# EAGLE design nintendac (EAGLE 7.7.0)
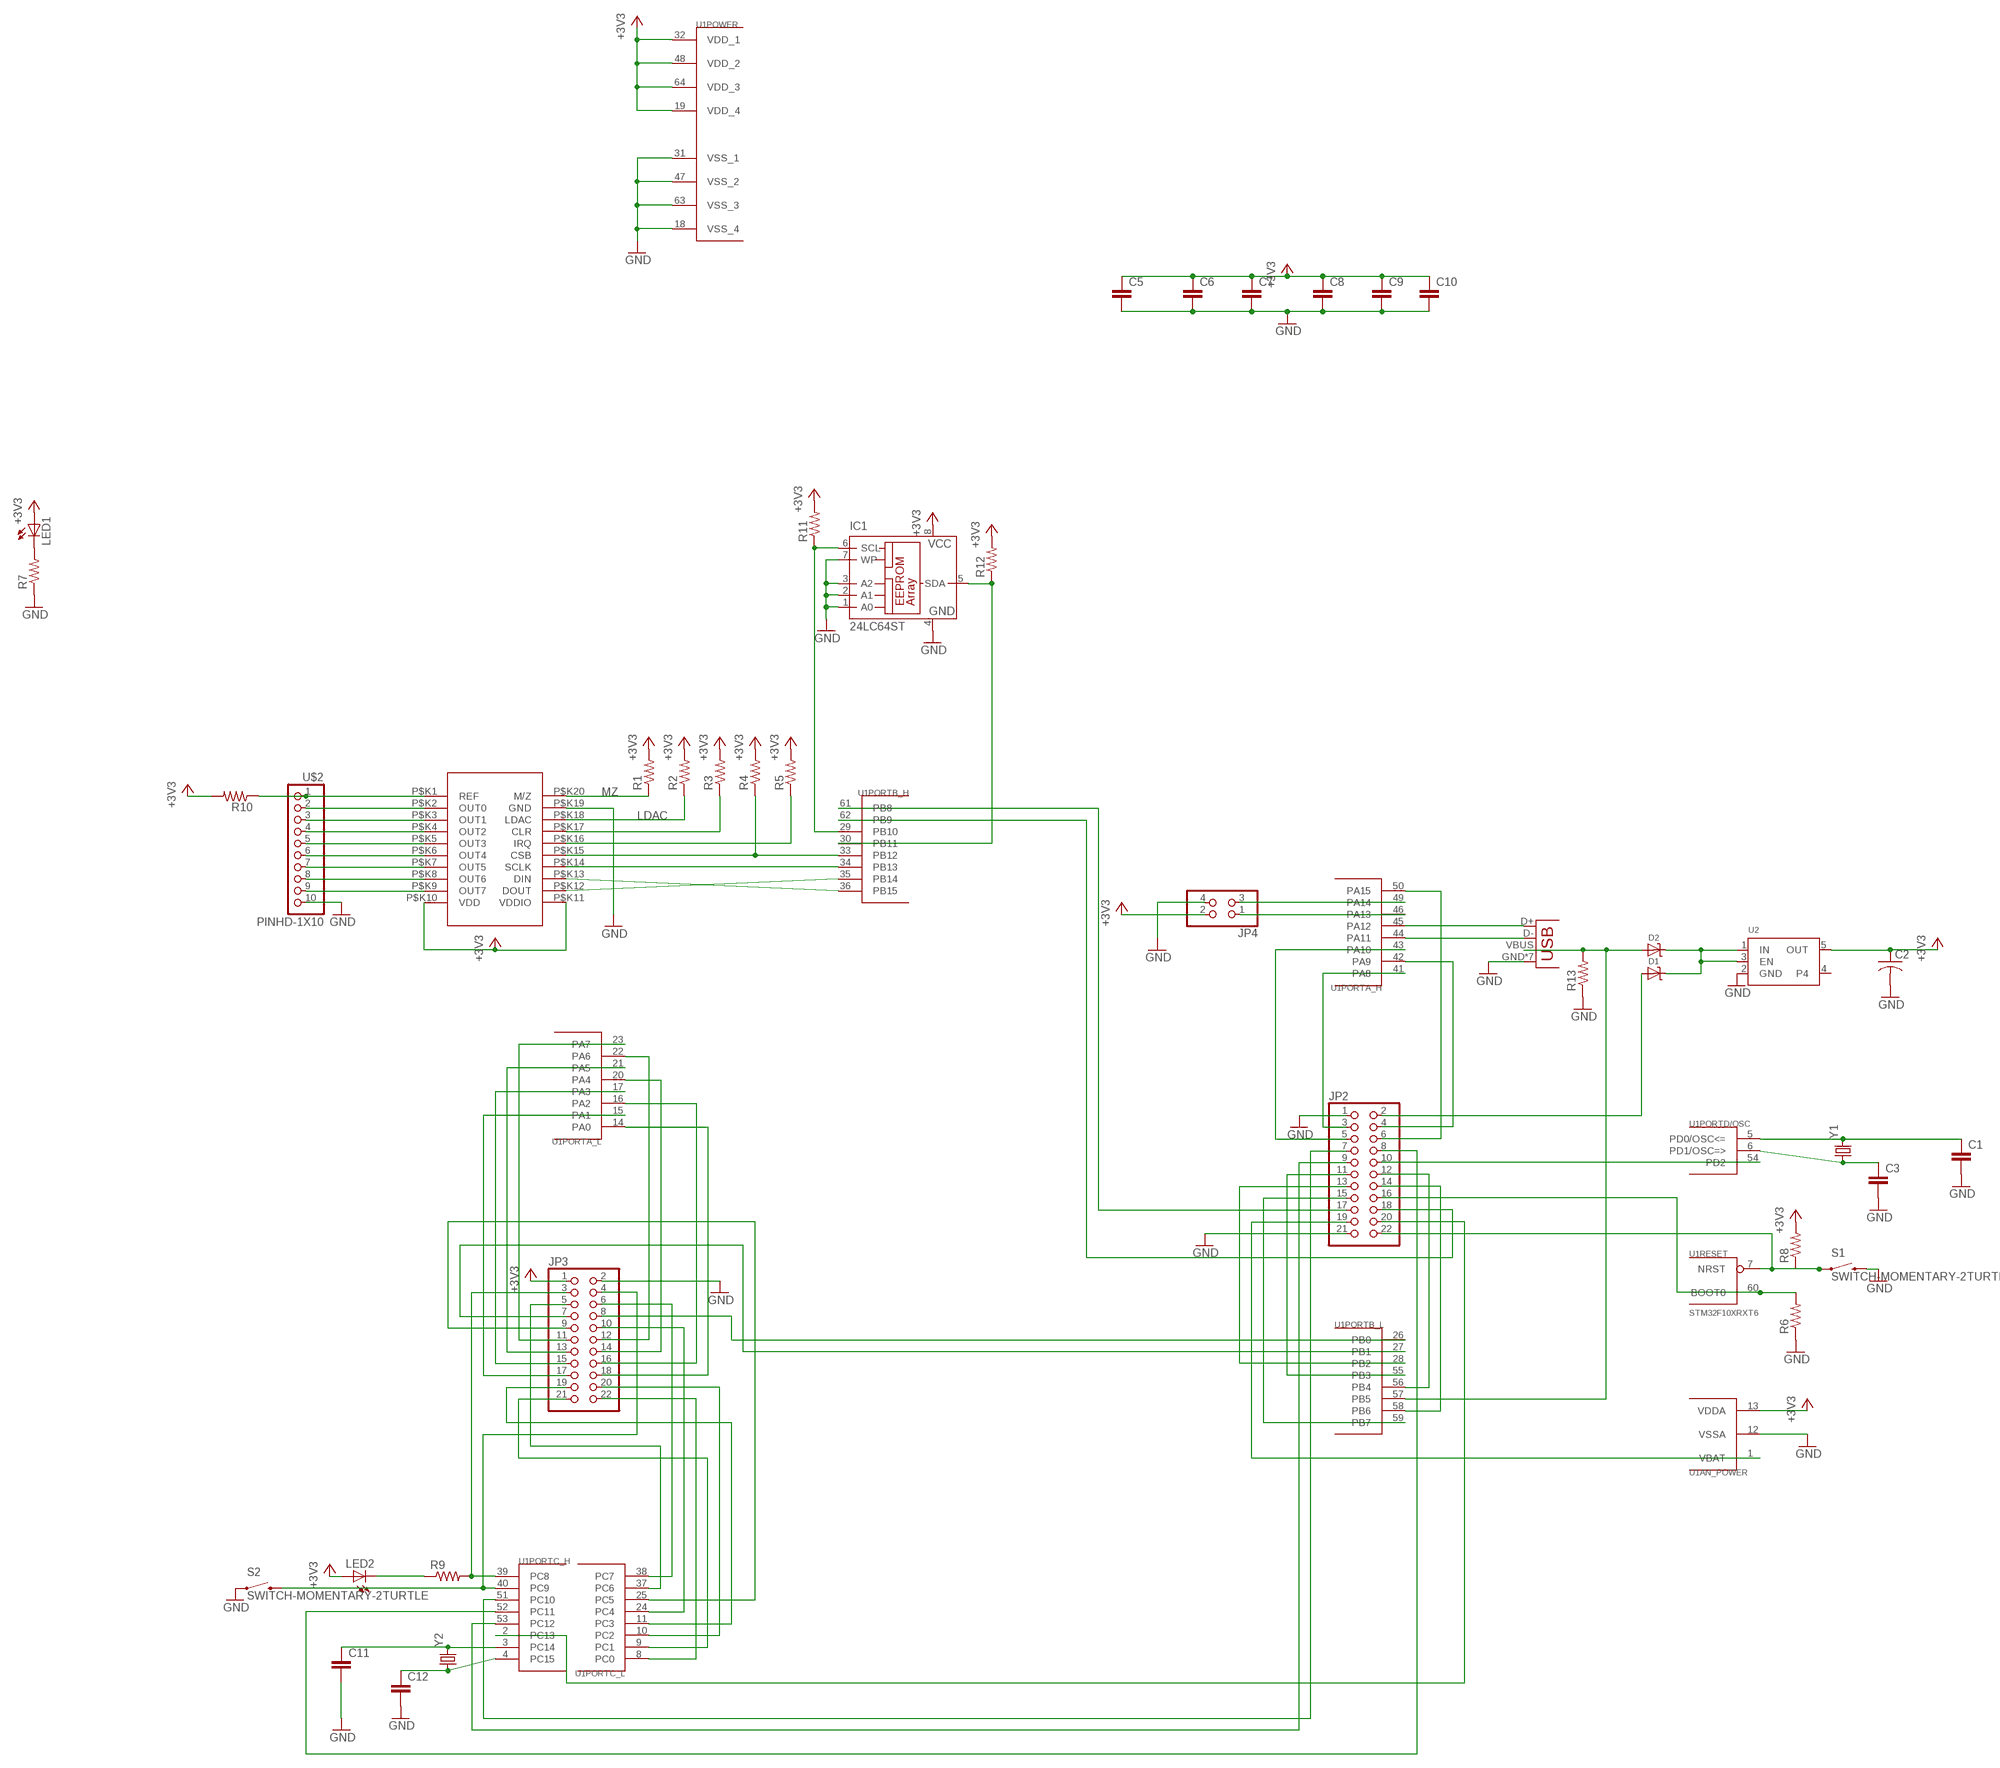
[diagram p0: schematic, sheet 1]

## Parts
C1  CAP0805  [0805]
C2  C-USC1210  [C1210]
C3  CAP0805  [0805]
C5  CAP0805  [0805]
C6  CAP0805  [0805]
C7  CAP0805  [0805]
C8  CAP0805  [0805]
C9  CAP0805  [0805]
C10  CAP0805  [0805]
C11  CAP0805  [0805]
C12  CAP0805  [0805]
D1  DIODE-SCHOTTKYSOD-123  [SOD-123]
D2  DIODE-SCHOTTKYSOD-123  [SOD-123]
IC1  24LC64ST  [TSSOP8]
JP2  PINHD-2X11  [2X11]
JP3  PINHD-2X11  [2X11]
JP4  PINHD-2X2  [2X02]
LED1  LEDCHIP-LED0805  [CHIP-LED0805]
LED2  LEDCHIP-LED0805  [CHIP-LED0805]
R1  RESISTOR0805-RES  [0805]
R2  RESISTOR0805-RES  [0805]
R3  RESISTOR0805-RES  [0805]
R4  RESISTOR0805-RES  [0805]
R5  RESISTOR0805-RES  [0805]
R6  RESISTOR0805-RES  [0805]
R7  RESISTOR0805-RES  [0805]
R8  RESISTOR0805-RES  [0805]
R9  RESISTOR0805-RES  [0805]
R10  RESISTOR0805-RES  [0805]
R11  RESISTOR0805-RES  [0805]
R12  RESISTOR0805-RES  [0805]
R13  RESISTOR0805-RES  [0805]
S1  SWITCH-MOMENTARY-2TURTLE  [KMR2]
S2  SWITCH-MOMENTARY-2TURTLE  [KMR2]
U1  STM32F10XRXT6  [TQFP64]
U2  VREG_SOT23-5  [SOT23-5]
U$1  MAX572X  [TSSOP20]
U$2  PINHD-1X10  [1X10-BIG]
X1  USB-MICROB  [USB-MICROB]
Y1  CRYSTALHC49US  [HC49US]
Y2  CRYSTALTC26H_EZ  [TC26HEZ]

## Nets
+3V3: C2.1 C5.1 C6.1 C7.1 C8.1 C9.1 C10.1 IC1.8(VCC) JP3.1 JP4.2 LED1.A LED2.A R1.2 R2.2 R3.2 R4.2 R5.2 R8.2 R10.2 R11.2 R12.2 U1.13(AN_POWER:VDDA) U1.19(POWER:VDD_4) U1.32(POWER:VDD_1) U1.48(POWER:VDD_2) U1.64(POWER:VDD_3) U2.5(OUT) U$1.P$K10(VDD) U$1.P$K11(VDDIO)
GND: C1.2 C2.2 C3.2 C5.2 C6.2 C7.2 C8.2 C9.2 C10.2 C11.2 C12.2 IC1.1(A0) IC1.2(A1) IC1.3(A2) IC1.4(GND) IC1.7(WP) JP2.1 JP2.21 JP3.2 JP4.4 R6.1 R7.1 R13.1 S1.3 S2.1 U1.12(AN_POWER:VSSA) U1.18(POWER:VSS_4) U1.31(POWER:VSS_1) U1.47(POWER:VSS_2) U1.63(POWER:VSS_3) U2.2(GND) U$1.P$K19(GND) U$2.10 X1.GND X1.P1(GND) X1.P2(GND) X1.P3(GND) X1.P4(GND) X1.P5(GND) X1.P6(GND)
LDAC: R2.1 U$1.P$K18(LDAC)
MZ: R1.1 U$1.P$K20(M/Z)
N$1: JP2.22 R8.1 S1.1 U1.7(RESET:NRST)
N$2: D1.C D2.C U2.1(IN) U2.3(EN)
N$3: U1.44(PORTA_H:PA11) X1.D-
N$4: U1.45(PORTA_H:PA12) X1.D+
N$5: C1.1 U1.5(PORTD/OSC:PD0/OSC<=) Y1.2
N$6: C3.1 U1.6(PORTD/OSC:PD1/OSC=>) Y1.1
N$7: R10.1 U$1.P$K1(REF) U$2.1
N$8: U$1.P$K2(OUT0) U$2.2
N$9: U$1.P$K3(OUT1) U$2.3
N$10: U$1.P$K4(OUT2) U$2.4
N$11: U$1.P$K5(OUT3) U$2.5
N$12: U$1.P$K6(OUT4) U$2.6
N$13: U$1.P$K7(OUT5) U$2.7
N$14: U$1.P$K8(OUT6) U$2.8
N$15: U$1.P$K9(OUT7) U$2.9
N$16: U1.36(PORTB_H:PB15) U$1.P$K13(DIN)
N$17: U1.35(PORTB_H:PB14) U$1.P$K12(DOUT)
N$18: U1.34(PORTB_H:PB13) U$1.P$K14(SCLK)
N$19: R4.1 U1.33(PORTB_H:PB12) U$1.P$K15(CSB)
N$20: R5.1 U$1.P$K16(IRQ)
N$21: R3.1 U$1.P$K17(CLR)
N$22: JP4.3 U1.49(PORTA_H:PA14)
N$23: JP3.5 U1.37(PORTC_L:PC6)
N$24: JP4.1 U1.46(PORTA_H:PA13)
N$25: JP3.6 U1.38(PORTC_L:PC7)
N$26: JP2.16 R6.2 U1.60(RESET:BOOT0)
N$27: LED1.C R7.2
N$28: C11.1 U1.3(PORTC_H:PC14) Y2.2
N$29: C12.1 U1.4(PORTC_H:PC15) Y2.1
N$30: JP3.4 S2.3 U1.40(PORTC_H:PC9)
N$31: JP2.3 U1.41(PORTA_H:PA8)
N$32: JP3.3 R9.2 U1.39(PORTC_H:PC8)
N$33: JP2.4 U1.42(PORTA_H:PA9)
N$34: JP2.5 U1.43(PORTA_H:PA10)
N$35: JP3.7 U1.27(PORTB_L:PB1)
N$36: JP3.8 U1.26(PORTB_L:PB0)
N$37: JP3.9 U1.25(PORTC_L:PC5)
N$38: JP3.10 U1.24(PORTC_L:PC4)
N$39: JP3.11 U1.23(PORTA_L:PA7)
N$40: JP3.12 U1.22(PORTA_L:PA6)
N$41: JP3.13 U1.21(PORTA_L:PA5)
N$42: JP3.14 U1.20(PORTA_L:PA4)
N$43: JP3.15 U1.17(PORTA_L:PA3)
N$44: JP3.16 U1.16(PORTA_L:PA2)
N$45: JP3.17 U1.15(PORTA_L:PA1)
N$46: JP3.18 U1.14(PORTA_L:PA0)
N$47: JP3.22 U1.8(PORTC_L:PC0)
N$48: JP3.21 U1.9(PORTC_L:PC1)
N$49: JP3.20 U1.10(PORTC_L:PC2)
N$50: JP3.19 U1.11(PORTC_L:PC3)
N$51: JP2.6 U1.50(PORTA_H:PA15)
N$52: JP2.7 U1.51(PORTC_H:PC10)
N$53: JP2.9 U1.53(PORTC_H:PC12)
N$54: JP2.8 U1.52(PORTC_H:PC11)
N$55: JP2.10 U1.54(PORTD/OSC:PD2)
N$56: JP2.11 U1.55(PORTB_L:PB3)
N$57: JP2.12 U1.56(PORTB_L:PB4)
N$58: D2.A R13.2 U1.57(PORTB_L:PB5) X1.VBUS
N$59: JP2.14 U1.58(PORTB_L:PB6)
N$60: JP2.15 U1.59(PORTB_L:PB7)
N$61: JP2.17 U1.61(PORTB_H:PB8)
N$62: JP2.18 U1.62(PORTB_H:PB9)
N$63: JP2.19 U1.1(AN_POWER:VBAT)
N$64: JP2.20 U1.2(PORTC_H:PC13)
N$65: LED2.C R9.1
N$66: D1.A JP2.2
N$67: IC1.6(SCL) R11.1 U1.29(PORTB_H:PB10)
N$68: IC1.5(SDA) R12.1 U1.30(PORTB_H:PB11)
N$69: JP2.13 U1.28(PORTB_L:PB2)
Unconnected: U2.4

## Library data of the parts
C1 C3 C5-C12 = backplane:CAP: Capacitor Standard 0603 ceramic capacitor, and 0.1" leaded capacitor.
C2 = backplane:C-US: CAPACITOR, American symbol
D1 D2 = nintendac_mini:DIODE-SCHOTTKY
IC1 = nintendac_mini:24*: Serial EEPROM I2C; MF: MICROCHIP; MPN: 24LC64X-I/ST; OC_FARNELL: 1296582; OC_NEWARK: 96K4081
JP2 JP3 = pinhead:PINHD-2X11: PIN HEADER
JP4 = pinhead:PINHD-2X2: PIN HEADER
LED1 LED2 = backplane:LED: LED OSRAM: - CHIPLED LG R971, LG N971, LY N971, LG Q971, LY Q971, LO R971, LY R971 LH N974, LH R974 LS Q976, LO Q976, LY Q976 LO Q996 - Hyper CHIPLED LW Q18S LB Q993, LB Q99A, LB R99A - SideLED LS A670, LO A670, LY A670, LG A670, LP A670 LB A673, LV A673, LT A673, LW A673 LH A674 LY A675 LS A676, LA A676, LO A676, LY A676, LW A676 LS A679, LY A679, LG A679 - Hyper Micro SIDELED® LS Y876, LA Y876, LO Y876, LY Y876 LT Y87S - SmartLED LW L88C, LW L88S LB L89C, LB L89S, LG L890 LS L89K, LO L89K, LY L89K LS L896, LA L896, LO L896, LY L896 - TOPLED LS T670, LO T670, LY T670, LG T670, LP T670 LSG T670, LSP T670, LSY T670, LOP T670, LYG T670 LG T671, LOG T671, LSG T671 LB T673, LV T673, LT T673, LW T673 LH T674 LS T676, LA T676, LO T676, LY T676, LB T676, LH T676, LSB T676, LW T676 LB T67C, LV T67C, LT T67C, LS T67K, LO T67K, LY T67K, LW E67C LS E67B, LA E67B, LO E67B, LY E67B, LB E67C, LV E67C, LT E67C LW T67C LS T679, LY T679, LG T679 LS T770, LO T770, LY T770, LG T770, LP T770 LB T773, LV T773, LT T773, LW T773 LH T774 LS E675, LA E675, LY E675, LS T675 LS T776, LA T776, LO T776, LY T776, LB T776 LHGB T686 LT T68C, LB T68C - Hyper Mini TOPLED® LB M676 - Mini TOPLED Santana® LG M470 LS M47K, LO M47K, LY M47K Source: http://www.osram.convergy.de/
R1-R13 = SparkFun-Passives:RESISTOR: Resistor Basic schematic elements and footprints for 0603, 1206, and PTH resistors.
S1 S2 = Adafruit Feather M0 Adalogger:SWITCH-MOMENTARY-2: Various NO switches- pushbuttons, reed, etc
U1 = backplane:STM32F10XRXT6: STM32F101/103 64pin LQFP
U2 = nintendac_mini:VREG_SOT23-5: SOT23-5 Fixed Voltage Regulators Part Current Out V Out V In V Dropout ?JA (°C/W) TJ (°C) Digikey Part No. ADP121 150mA 3.3V 3.4-5.5V 0.09V @ 150mA -- -- ADP121-AUJZ33R7CT-ND ADP121 150mA 3.0V 3.1-5.5V 0.09V @ 150mA -- -- ADP121-AUJZ30R7CT-ND ADP122 300mA 3.3V 3.4-5.5V 0.085V @ 300mA -- -- ADP122AUJZ-3.3-R7CT-ND ADP1712 300mA 3.3V 3.5-5.5V 0.17V @ 300mA -- -- ADP1712AUJZ-3.3-R7TR-ND AP7311 (Low Cost) 150mA 3.3V 3.5-6V 0.15V @ 150mA -- -- AP7311-33WG-7DICT-ND LD39015M18R 150mA 1.8V 1.9V-5.5V 0.08V @ 100mA -- -- 497-6977-1-ND LP2985A-33DBVR 150mA 3.3V 3.3-16V 0.28V @ 150mA 206 150 296-18479-1-ND MCP1824T-3302E/OT 300mA 3.3V 3.5V-6V 0.2V @ 300mA -- -- MCP1824T-3302E/OTCT-ND MIC5205-2.5YM5 TR 150mA 2.5V 2.7-16V 0.165V @ 150mA -- -- 576-1257-2-ND MIC5205-3.0YM5 TR 150mA 3.0V 3.2V-16V 0.165V @ 150mA -- -- 576-1258-2-ND MIC5205-3.3YM5 TR 150mA 3.3V 3.5V-16V 0.165V @ 150mA -- -- 576-1259-2-ND TPS780330220 150mA 3.3V+2.2V 3.6-5.5V 250mV Max -- -- 296-23332-1-ND TDA3663/N1,135 100mA 3.3V 3.5-45V 0.18V @ 50mA -- -- 568-5343-1-ND Max operating temp can be calculated using ?JA, TJ (max junction temperature), and power in watts. Set the "Maximum Ambient Temperature" until it reaches TJ ("Max Junction Temperature"), which is the absolute limit for safe use of the regulator: Heat Sink Temperature Calculator <http://www.daycounter.com/Calculators/Heat-Sink-Temperature-Calculator.phtml> For example, With 12V source into a 3.3V LP2985 and a 30mA load, we are dissipating (12V-3.3V) * 0.03A = 0.261W. With a ?JA of 206 °C/W, a TJ of 150°C, and 261mW we can safely use the chip without a heat sink up to 75°C (=147.1°C Junction Temperature).
U$1 = kevin:MAX572X
U$2 = adafruit:PINHD-1X10: Pin header 1x10 0.1" spacing With round pins
X1 = backplane:USB: USB Connectors USB-B-PTH is fully proven SKU : PRT-00139/CONN-08278 USB-miniB is fully proven SKU : PRT-00587 USB-A-PCB is untested. USB-A-H is throughly reviewed, but untested. Spark Fun Electronics SKU : PRT-00437 USB-B-SMT is throughly reviewed, but untested. Needs silkscreen touching up. USB-A-S has not been used/tested USB-MB-H has not been used/tested USB-MICROB has been used. CONN-09505; PROD_ID: CONN-09505
Y1 Y2 = backplane:CRYSTAL: Various standard crystals. Proven footprints.

## Board
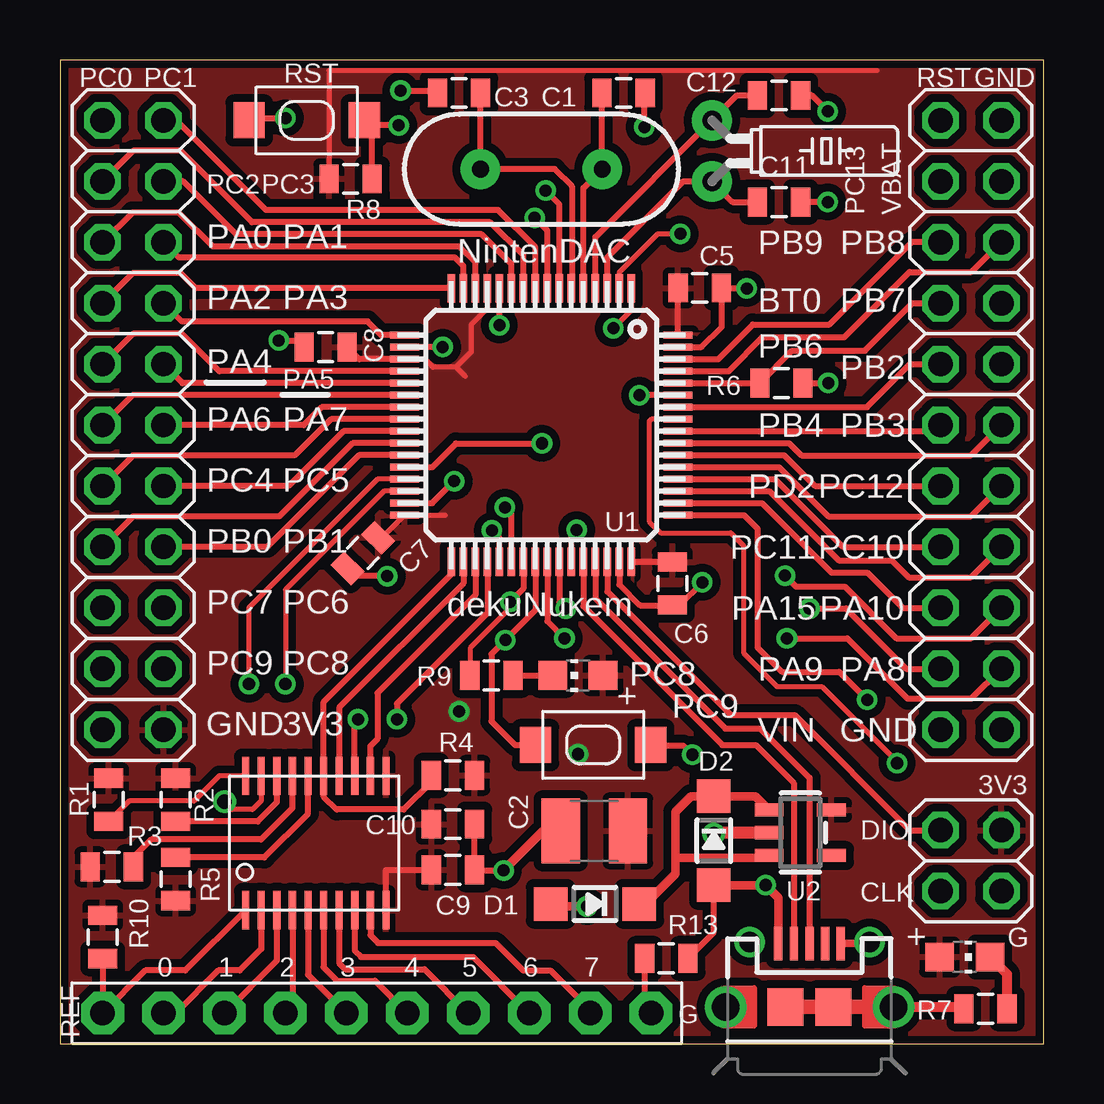
[diagram p1: board, top side]
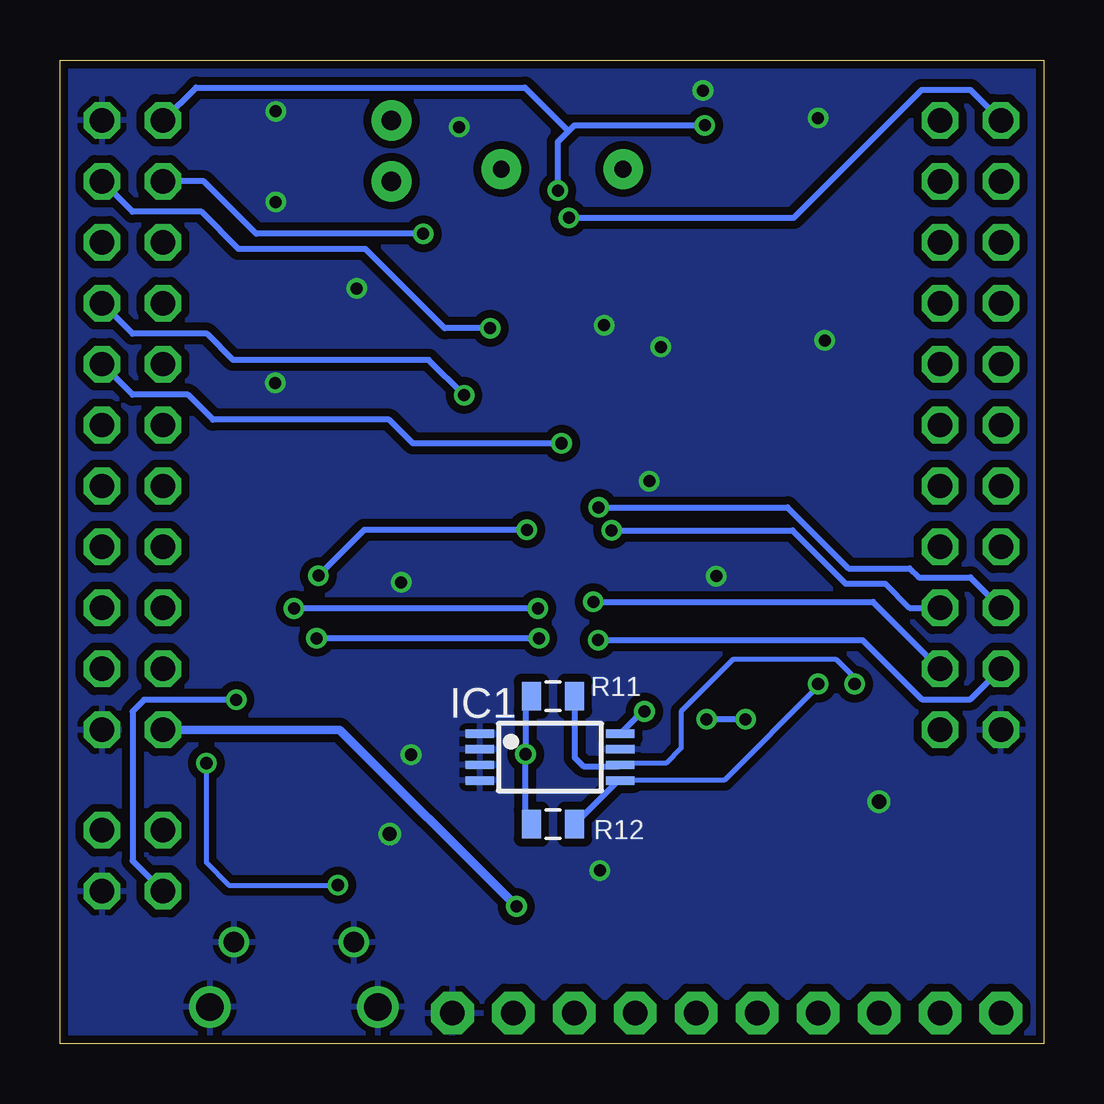
[diagram p2: board, bottom side, seen from below]

Size 41 x 41 mm. Coordinates in mm from the lower left corner, seen from the top.
Outline: 0,0 41,0 41,41 0,41 0,0
Copper layers (1*16): Top 0.035mm / dielectric 1.5mm / Bottom 0.035mm
Design rules "SparkFun-2-layer-TIGHT": minimum track width 7mil, minimum drill 15mil, track to track 7mil, track to pad 7mil, pad to pad 7mil, via to via 7mil, smd to smd 7mil, copper to edge 7mil, drill to drill 7mil, minimum pad ring 7mil, minimum via ring 7mil, stop-mask expansion 4mil, vias tented up to drill 25mil, thermal gap 10mil

### Footprints (pad centres in the part's own frame; a part is rotated, then mirrored left to right if it is on the bottom)
0805 = smd 0.8 x 1.2: 1 -0.9,0; 2 0.9,0
C1210 = smd 1.6 x 2.7: 1 -1.4,0; 2 1.4,0
SOD-123 = smd 1.4 x 1.4: A 1.85,0; C -1.85,0
TSSOP8 = smd 0.35 x 1.2: 1 -0.975,-2.925; 2 -0.325,-2.925; 3 0.325,-2.925; 4 0.975,-2.925; 5 0.975,2.925; 6 0.325,2.925; 7 -0.325,2.925; 8 -0.975,2.925
2X11 = drill 1.016 octagon: 1 -12.7,-1.27; 2 -12.7,1.27; 3 -10.16,-1.27; 4 -10.16,1.27; 5 -7.62,-1.27; 6 -7.62,1.27; 7 -5.08,-1.27; 8 -5.08,1.27; 9 -2.54,-1.27; 10 -2.54,1.27; 11 0,-1.27; 12 0,1.27; 13 2.54,-1.27; 14 2.54,1.27; 15 5.08,-1.27; 16 5.08,1.27; 17 7.62,-1.27; 18 7.62,1.27; 19 10.16,-1.27; 20 10.16,1.27; 21 12.7,-1.27; 22 12.7,1.27
2X02 = drill 1.016 octagon: 1 -1.27,-1.27; 2 -1.27,1.27; 3 1.27,-1.27; 4 1.27,1.27
CHIP-LED0805 = smd 1.2 x 1.2: A 0,-1.05; C 0,1.05
KMR2 = smd 1.3 x 1.5: 1 2.4,0; 3 -2.4,0
TQFP64 = smd 1.2 x 0.3: 1 -5.7,3.75; 2 -5.7,3.25; 3 -5.7,2.75; 4 -5.7,2.25; 5 -5.7,1.75; 6 -5.7,1.25; 7 -5.7,0.75; 8 -5.7,0.25; 9 -5.7,-0.25; 10 -5.7,-0.75; 11 -5.7,-1.25; 12 -5.7,-1.75; 13 -5.7,-2.25; 14 -5.7,-2.75; 15 -5.7,-3.25; 16 -5.7,-3.75; 33 5.7,-3.75; 34 5.7,-3.25; 35 5.7,-2.75; 36 5.7,-2.25; 37 5.7,-1.75; 38 5.7,-1.25; 39 5.7,-0.75; 40 5.7,-0.25; 41 5.7,0.25; 42 5.7,0.75; 43 5.7,1.25; 44 5.7,1.75; 45 5.7,2.25; 46 5.7,2.75; 47 5.7,3.25; 48 5.7,3.75 | smd 0.3 x 1.2: 17 -3.75,-5.7; 18 -3.25,-5.7; 19 -2.75,-5.7; 20 -2.25,-5.7; 21 -1.75,-5.7; 22 -1.25,-5.7; 23 -0.75,-5.7; 24 -0.25,-5.7; 25 0.25,-5.7; 26 0.75,-5.7; 27 1.25,-5.7; 28 1.75,-5.7; 29 2.25,-5.7; 30 2.75,-5.7; 31 3.25,-5.7; 32 3.75,-5.7; 49 3.75,5.7; 50 3.25,5.7; 51 2.75,5.7; 52 2.25,5.7; 53 1.75,5.7; 54 1.25,5.7; 55 0.75,5.7; 56 0.25,5.7; 57 -0.25,5.7; 58 -0.75,5.7; 59 -1.25,5.7; 60 -1.75,5.7; 61 -2.25,5.7; 62 -2.75,5.7; 63 -3.25,5.7; 64 -3.75,5.7
SOT23-5 = smd 0.55 x 1.2: 1 -0.95,-1.3; 2 0,-1.3; 3 0.95,-1.3; 4 0.95,1.3; 5 -0.95,1.3
TSSOP20 = smd 0.3 x 1.6: P$K1 -2.93,-2.825; P$K2 -2.28,-2.825; P$K3 -1.63,-2.825; P$K4 -0.98,-2.825; P$K5 -0.33,-2.825; P$K6 0.32,-2.825; P$K7 0.97,-2.825; P$K8 1.62,-2.825; P$K9 2.27,-2.825; P$K10 2.92,-2.825; P$K11 2.92,2.775; P$K12 2.27,2.775; P$K13 1.62,2.775; P$K14 0.97,2.775; P$K15 0.32,2.775; P$K16 -0.33,2.775; P$K17 -0.98,2.775; P$K18 -1.63,2.775; P$K19 -2.28,2.775; P$K20 -2.93,2.775
1X10-BIG = drill 1.016 pad 1.778 octagon: 1 -11.43,0; 2 -8.89,0; 3 -6.35,0; 4 -3.81,0; 5 -1.27,0; 6 1.27,0; 7 3.81,0; 8 6.35,0; 9 8.89,0; 10 11.43,0
USB-MICROB = smd 0.35 x 1.4: D+ 0,2.65; D- -0.65,2.65; GND 1.3,2.65; ID 0.65,2.65; VBUS -1.3,2.65 | smd 1.5 x 1.55: P1 -1,0; P2 1,0 | drill 1.15 pad 1.422: P3 -3.5,0; P4 3.5,0 | drill 0.85 pad 1.27: P5 -2.5,2.7; P6 2.5,2.7
HC49US = drill 0.7 pad 1.651: 1 -2.54,0; 2 2.54,0
TC26HEZ = drill 0.813 pad 1.676: 1 -1.27,0; 2 1.27,0

### Placement (x,y rotation side)
C1  23.5,39.62 0 top
C2  22.28,8.86 180 top
C3  16.64,39.62 180 top
C5  26.67,31.5 0 top
C6  25.53,19.18 270 top
C7  12.62,20.45 225 top
C8  11.07,29.03 180 top
C9  16.38,7.24 0 top
C10  16.38,9.14 0 top
C11  29.97,35.08 0 top
C12  29.97,39.52 0 top
D1  22.3,5.82 180 top
D2  27.25,8.46 270 top
IC1  20.57,11.94 270 bottom
JP2  37.97,25.78 90 top
JP3  3.05,25.78 90 top
JP4  37.97,7.62 270 top
LED1  37.72,3.61 270 top
LED2  21.59,15.34 90 top
R1  2.03,10.16 90 top
R2  4.83,10.16 90 top
R3  2.16,7.37 180 top
R4  16.38,11.18 0 top
R5  4.83,6.86 270 top
R6  30.07,27.53 180 top
R7  38.58,1.45 0 top
R8  12.12,36.04 180 top
R9  17.98,15.34 180 top
R10  1.78,4.45 90 top
R11  20.45,14.48 180 bottom
R12  20.45,9.14 180 bottom
R13  25.27,3.56 0 top
S1  10.29,38.48 0 top
S2  22.23,12.45 0 top
U1  20.07,25.78 270 top
U2  30.86,8.79 270 top
U$1  10.67,8.38 0 top
U$2  13.21,1.27 0 top
X1  31.24,1.52 0 top
Y1  20.07,36.45 0 top
Y2  27.18,37.21 270 top

### Tracks (layer width: path | path; a pad name or v marks a point on that pad's centre or on a via)
+3V3  (via drill 0.51)
  Top 0.203: C7.1 13.42,21.08 U1.32 16.06,22.03 | 17.83,31.47 17.83,30.66 17.14,29.97 17.14,28.83 16.51,28.19 | 16.51,28.19 15.54,28.19 15.21,28.52 U1.19 | 16.89,27.81 16.51,28.19 | 34.06,40.56 11.22,40.56 R8.2
  Top 0.254: C6.1 U1.48 | 17.83,31.47 U1.13 | U1.64 C5.1 | U1.19 12.48,28.53 C8.1 | U$1.P$K10 13.59,7.24 15.42,7.24
  Bottom 0.254: R12.2 21.59,9.39 v21.59,12.06 21.59,14.23 R11.2 | v16.64,13.84 16.72,13.84 IC1.8
  pour Top (isolate 0.33): 0,41 0,0 41,0 41,41
GND  (via drill 0.5, 0.51, 0.58, 0.6)
  Top 0.203: U$1.P$K19 8.39,10.12 8.03,9.75 7.19,9.75 v6.86,10.08
  Top 0.254: 33.69,4.17 X1.P6 | C10.2 C9.2 17.31,7.21 v18.49,7.21 | v15.95,29.03 U1.18 | v18.31,29.95 U1.12 | U1.63 26.75,29.03 27.58,29.87 27.58,31.48 | 27.58,31.48 C5.2 | R6.1 v32.03,27.53 | U1.47 23.32,19.13 24.18,18.26 25.51,18.26 C6.2 25.82,18.28 v26.77,19.23 | 11.89,19.81 C7.2 | C7.2 12.07,19.81 | v13.64,19.48 12.32,19.48 C7.2 | 27.58,31.48 28.61,31.48 v28.63,31.47 | v9.12,29.31 9.89,29.31 C8.2 | v32,35.08 C11.2 | v14.2,39.73 15.63,39.73 C3.2 | v24.36,38.2 24.36,39.59 C1.2 | S1.3 7.99,38.58 v9.4,38.58 | S2.1 24.62,12.42 25.98,12.42 v26.36,12.04 | R13.1 24.37,1.53 U$2.10 | U1.31 15.52,22.53 v16.43,23.44 | v32,38.86 31.34,39.52 C12.2
  Top 0.305: X1.GND 33.69,4.17
  Top 0.356: v18.49,7.21 20.14,8.87 C2.2
  Top 0.406: X1.P4 37.68,1.52 R7.1
  Top 0.508: U2.2 27.3,8.79 v27.25,8.74
  Top 0.61: X1.P4 X1.P2 X1.P1
  pour Bottom (isolate 0.33): 0,41 0,0 41,0 41,41
LDAC
  Top 0.254: U$1.P$K18 9.04,10.62 | 9.04,10.62 9.04,10.05 8.24,9.26 R2.1 | 9.04,10.62
MZ
  Top 0.203: U$1.P$K20 6.64,11.16 5.59,10.11 2.88,10.11 R1.1
N$1  (via drill 0.5)
  Top 0.254: U1.7 20.82,34.99 v20.24,35.56 | R8.1 13.02,38.15 S1.1 12.89,38.28 v14.12,38.28
  Bottom 0.254: v14.12,38.28 19.56,38.28 19.82,38.01 | v20.24,35.56 20.24,37.59 19.82,38.01 | JP2.22 35.33,39.85 21.61,39.85 19.82,38.06 19.82,38.01
N$2
  Top 0.356: U2.1 28.99,10.31 D2.C 26.31,10.31 25.65,9.65 25.65,7.75 | 25.65,7.75 25.65,7.07 24.41,5.82 D1.C | U2.3 29.47,7.75 25.65,7.75
N$3
  Top 0.254: U1.44 21.82,18.24 27.61,12.45 29.01,12.45 30.59,10.86 X1.D-
N$4
  Top 0.254: U1.45 22.33,18.54 27.74,13.13 29.18,13.13 31.24,11.07 X1.D+
N$5
  Top 0.254: U1.5 21.82,35.66 Y1.2 22.59,36.46 C1.1
N$6
  Top 0.254: U1.6 21.34,31.5 21.34,35.74 20.62,36.45 Y1.1 17.53,39.61 C3.1
N$7
  Top 0.254: U$1.P$K1 5.23,3.05 3.56,3.05 U$2.1 | 1.8,1.29 U$2.1 | R10.1 U$2.1
N$8
  Top 0.254: U$1.P$K2 8.39,3.94 7.49,3.05 6.6,3.05 4.83,1.27 U$2.2
N$9
  Top 0.254: U$1.P$K3 9.04,3.45 U$2.3
N$10
  Top 0.254: U$1.P$K4 9.69,1.56 U$2.4
N$11
  Top 0.254: U$1.P$K5 10.34,2.87 U$2.5
N$12
  Top 0.254: U$1.P$K6 10.99,3.19 11.56,2.62 13.13,2.62 U$2.6
N$13
  Top 0.254: U$1.P$K7 11.64,3.35 11.89,3.1 15.19,3.1 U$2.7
N$14
  Top 0.254: U$1.P$K8 12.29,3.87 12.55,3.61 17.22,3.61 U$2.8
N$15
  Top 0.254: U$1.P$K9 12.94,4.51 13.26,4.19 18.16,4.19 19.3,3.05 20.45,3.05 22.1,1.4 U$2.9
N$16  (via drill 0.5)
  Top 0.254: U$1.P$K13 12.29,13.38 v12.42,13.51 | U1.36 17.82,17.94 14.05,14.17 v14.05,13.51 14.02,13.54
  Bottom 0.254: v12.42,13.51 v14.05,13.51
N$17
  Top 0.254: U1.35 17.32,18.69 13.23,14.61 13.23,12.7 12.93,12.39 U$1.P$K12
N$18
  Top 0.254: U1.34 16.82,19.18 11.64,14 U$1.P$K14
N$19
  Top 0.254: R4.1 15.48,10.91 14.33,9.75 11.53,9.75 11,10.29 11,11.15 U$1.P$K15 11,14.25 16.31,19.56 16.31,20.07 U1.33
N$20
  Top 0.254: U$1.P$K16 10.34,9.58 8.52,7.76 R5.1 5.34,7.76
N$21
  Top 0.254: 9.68,11.17 U$1.P$K17 9.69,9.81 8.38,8.51 3.81,8.51 3.06,7.76 R3.1
N$22  (via drill 0.5)
  Top 0.254: U1.49 28.52,22.03 29.08,21.46 29.08,16.51 30.1,15.49 32.49,15.49 v33.66,14.33
  Bottom 0.254: v33.66,14.33 37.49,14.33 37.97,13.84 37.97,7.62 JP4.3
N$23  (via drill 0.5)
  Top 0.254: U1.37 18.32,21.08 v18.01,21.39
  Bottom 0.254: JP3.5 5.59,18.16 6.6,19.18 8.26,19.18 10.46,21.39 v18.01,21.39
N$24
  Top 0.254: U1.46 22.82,18.84 27.96,13.69 30.63,13.69 35.43,8.89 JP4.1
N$25  (via drill 0.5)
  Top 0.254: U1.38 18.82,22.08 v18.54,22.35
  Bottom 0.254: JP3.6 3.05,19.43 5.21,19.43 5.59,19.81 8.13,19.81 10.67,22.35 v18.54,22.35
N$26
  Top 0.254: U1.60 R6.2 30.52,28.88 33.55,28.88 35.53,30.86 JP2.16
N$27
  Top 0.406: R7.2 39.48,2.89 LED1.C
N$28
  Top 0.254: U1.3 22.82,32.77 25.98,35.94 Y2.2 28.04,35.08 C11.1
N$29
  Top 0.254: U1.4 22.32,33.62 Y2.1 28.22,39.52 C12.1
N$30  (via drill 0.5)
  Top 0.254: U1.40 19.82,18.06 v18.57,16.82 17.98,16.23 17.98,13.44 18.97,12.45 S2.3
  Bottom 0.254: JP3.4 3.05,14.35 5.08,14.35 7.54,16.82 v18.57,16.82
N$31  (via drill 0.5)
  Top 0.254: JP2.3 38,14.38 35.33,14.38 32.82,16.89 v30.3,16.89 | U1.41 20.32,17.61 v21.03,16.89
  Bottom 0.254: v21.03,16.89 v30.3,16.89
N$32  (via drill 0.5)
  Top 0.203: v18.77,18.41 18.77,18.16 17.09,16.48 17.09,15.35 R9.2
  Top 0.254: U1.39 19.32,18.96 v18.77,18.41
  Bottom 0.254: v18.77,18.41 7.11,18.41 JP3.3
N$33  (via drill 0.5)
  Top 0.254: U1.42 20.82,18.4 v21.08,18.14 | JP2.4 35.28,15.62 32.77,18.14 v31.24,18.14
  Bottom 0.254: v21.08,18.14 v31.24,18.14
N$34  (via drill 0.5)
  Top 0.254: U1.43 21.32,21.19 v21.54,21.41 | JP2.5 37.97,16.89 34.87,16.89 32.72,19.05 30.68,19.05 v30.23,19.51
  Bottom 0.254: v21.54,21.41 28.32,21.41 v30.23,19.51
N$35
  Top 0.254: U1.27 12.47,24.53 8.64,20.7 JP3.7
N$36
  Top 0.254: U1.26 12.2,25.03 9.14,21.97 3.05,21.97 JP3.8
N$37
  Top 0.254: U1.25 11.81,25.53 9.53,23.24 JP3.9
N$38
  Top 0.254: U1.24 11.3,26.03 9.78,24.51 3.05,24.51 JP3.10
N$39
  Top 0.254: U1.23 10.91,26.53 10.16,25.78 JP3.11
N$40
  Top 0.254: U1.22 3.03,27.03 JP3.12
N$41
  Top 0.254: U1.21 5.11,27.53 JP3.13
N$42
  Top 0.254: U1.20 6.64,28.03 5.08,29.59 3.05,29.59 JP3.14
N$43
  Top 0.254: U1.17 13.39,29.53 12.83,30.1 5.08,30.1 JP3.15
N$44
  Top 0.254: U1.16 5.65,31.48 5.03,32.11 3.02,32.11 JP3.16
N$45
  Top 0.254: U1.15 16.82,32.41 16.46,32.77 4.95,32.77 JP3.17
N$46
  Top 0.254: U1.14 17.32,32.57 16.66,33.22 6.38,33.22 4.95,34.65 3.02,34.65 JP3.18
N$47  (via drill 0.5)
  Top 0.254: U1.8 20.32,33.89 v19.79,34.42
  Bottom 0.254: 1.78,38.46 JP3.22 3.05,39.75 5.08,39.75 10.41,34.42 v19.79,34.42
N$48
  Top 0.254: U1.9 19.82,33.19 18.26,34.75 8.59,34.75 4.88,38.46 4.34,38.46 JP3.21
N$49
  Top 0.254: U1.10 19.32,32.86 17.93,34.24 8,34.24 5.03,37.21 3.05,37.21 JP3.20
N$50
  Top 0.254: U1.11 18.82,32.49 17.58,33.73 7.34,33.73 5.13,35.94 JP3.19
N$51
  Top 0.254: U1.50 29.26,22.53 32.16,19.63 33.66,19.63 35.13,18.16 JP2.6
N$52
  Top 0.254: U1.51 29.57,23.03 32.46,20.14 34.67,20.14 35.38,19.43 37.97,19.43 JP2.7
N$53
  Top 0.254: U1.53 29.97,24.03 32.03,21.97 37.97,21.97 JP2.9
N$54
  Top 0.254: U1.52 29.81,23.53 32.64,20.7 JP2.8
N$55
  Top 0.254: U1.54 30.18,24.53 31.47,23.24 JP2.10
N$56
  Top 0.254: U1.55 30.39,25.03 30.91,24.51 37.97,24.51 JP2.11
N$57
  Top 0.254: U1.56 36.45,25.53 JP2.12
N$58  (via drill 0.51)
  Top 0.203: U1.57 24.66,26.03 24.56,25.93 24.56,21.77 25.04,21.29 27.96,21.29 28.5,20.75 28.5,16.28 29.9,14.88 31.75,14.88 34.9,11.73 v34.9,11.68
  Top 0.254: R13.2 27.25,4.64 D2.A
  Top 0.356: 27.51,6.35 D2.A v29.41,6.6 29.94,6.08 X1.VBUS
  Bottom 0.203: v34.9,11.68 34.9,7.54 33.96,6.6 v29.41,6.6
N$59
  Top 0.254: U1.58 33.64,26.53 35.43,28.32 JP2.14
N$60  (via drill 0.5)
  Top 0.254: U1.59 v24.16,27.03
  Bottom 0.254: v24.16,27.03 25.63,28.5 33.78,28.5 34.87,29.59 37.97,29.59 JP2.15
N$61
  Top 0.254: U1.61 27.88,28.03 29.29,29.44 32.69,29.44 35.41,32.16 38,32.16 JP2.17
N$62
  Top 0.254: U1.62 27.44,28.53 28.88,29.97 32.08,29.97 35.53,33.43 36.68,33.43 JP2.18
N$63  (via drill 0.5)
  Top 0.203: 23.82,31.69 U1.1 23.82,30.57 v23.06,29.82
  Bottom 0.254: v23.06,29.82 24.97,29.82 28.27,33.12 33.55,33.12 35.1,34.67 37.97,34.67 JP2.19
N$64  (via drill 0.5)
  Top 0.203: U1.2 23.32,32.16 24.92,33.76 v25.86,33.76
  Bottom 0.254: v25.86,33.76 32.82,33.76 35,35.94 JP2.20
N$65
  Top 0.254: R9.1 LED2.C
N$66  (via drill 0.51)
  Top 0.356: v21.97,5.71 20.55,5.71 D1.A
  Bottom 0.356: JP2.2 29.34,13.08 v21.97,5.71
N$67  (via drill 0.51)
  Top 0.203: U1.29 13.24,23.53 7.87,18.16 v7.87,14.99
  Bottom 0.203: IC1.6 17.58,11.68 15.75,11.68 15.11,12.32 15.11,13.84 12.95,16 8.64,16 7.87,15.24 v7.87,14.99
  Bottom 0.254: R11.1 19.55,11.93 19.18,11.56 17.7,11.56 IC1.6
N$68  (via drill 0.51)
  Top 0.203: U1.30 13.51,23.03 9.4,18.92 v9.4,14.99
  Bottom 0.203: 17.61,10.92 IC1.5 17.64,10.97 13.31,10.97 9.4,14.88 v9.4,14.99
  Bottom 0.254: R12.1 17.73,10.96 IC1.5
N$69  (via drill 0.51)
  Top 0.254: U1.28 15.52,24.03 16.51,25.02 v20.09,25.02
  Bottom 0.254: v20.09,25.02 26.29,25.02 27.28,26.01 34.62,26.01 35.66,27.05 37.97,27.05 JP2.13

### Text on the board
tNames: PC0 | PC1 | RST | RST | GND | PC2 | PC3 | PC13 | VBAT | NintenDAC | PA0 | PA1 | PB9 | PB8 | PA2 | PA3 | BT0 | PB7 | PB6 | PA4 | PB2 | PA5 | PA6 | PA7 | PB4 | PB3 | PD2 | PC12 | PC4 | PC5 | PC11 | PC10 | PB0 | PB1 | dekuNukem | PA15 | PA10 | PC7 | PC6 | PC9 | PC8 | PC8 | PA9 | PA8 | PC9 | GND | 3V3 | VIN | GND | 3V3 | DIO | CLK | G | 0 | 1 | 2 | 3 | 4 | 5 | 6 | 7 | G | REF